# EAGLE schematic rc-driver-dual-rev-b (EAGLE 7.2.0)
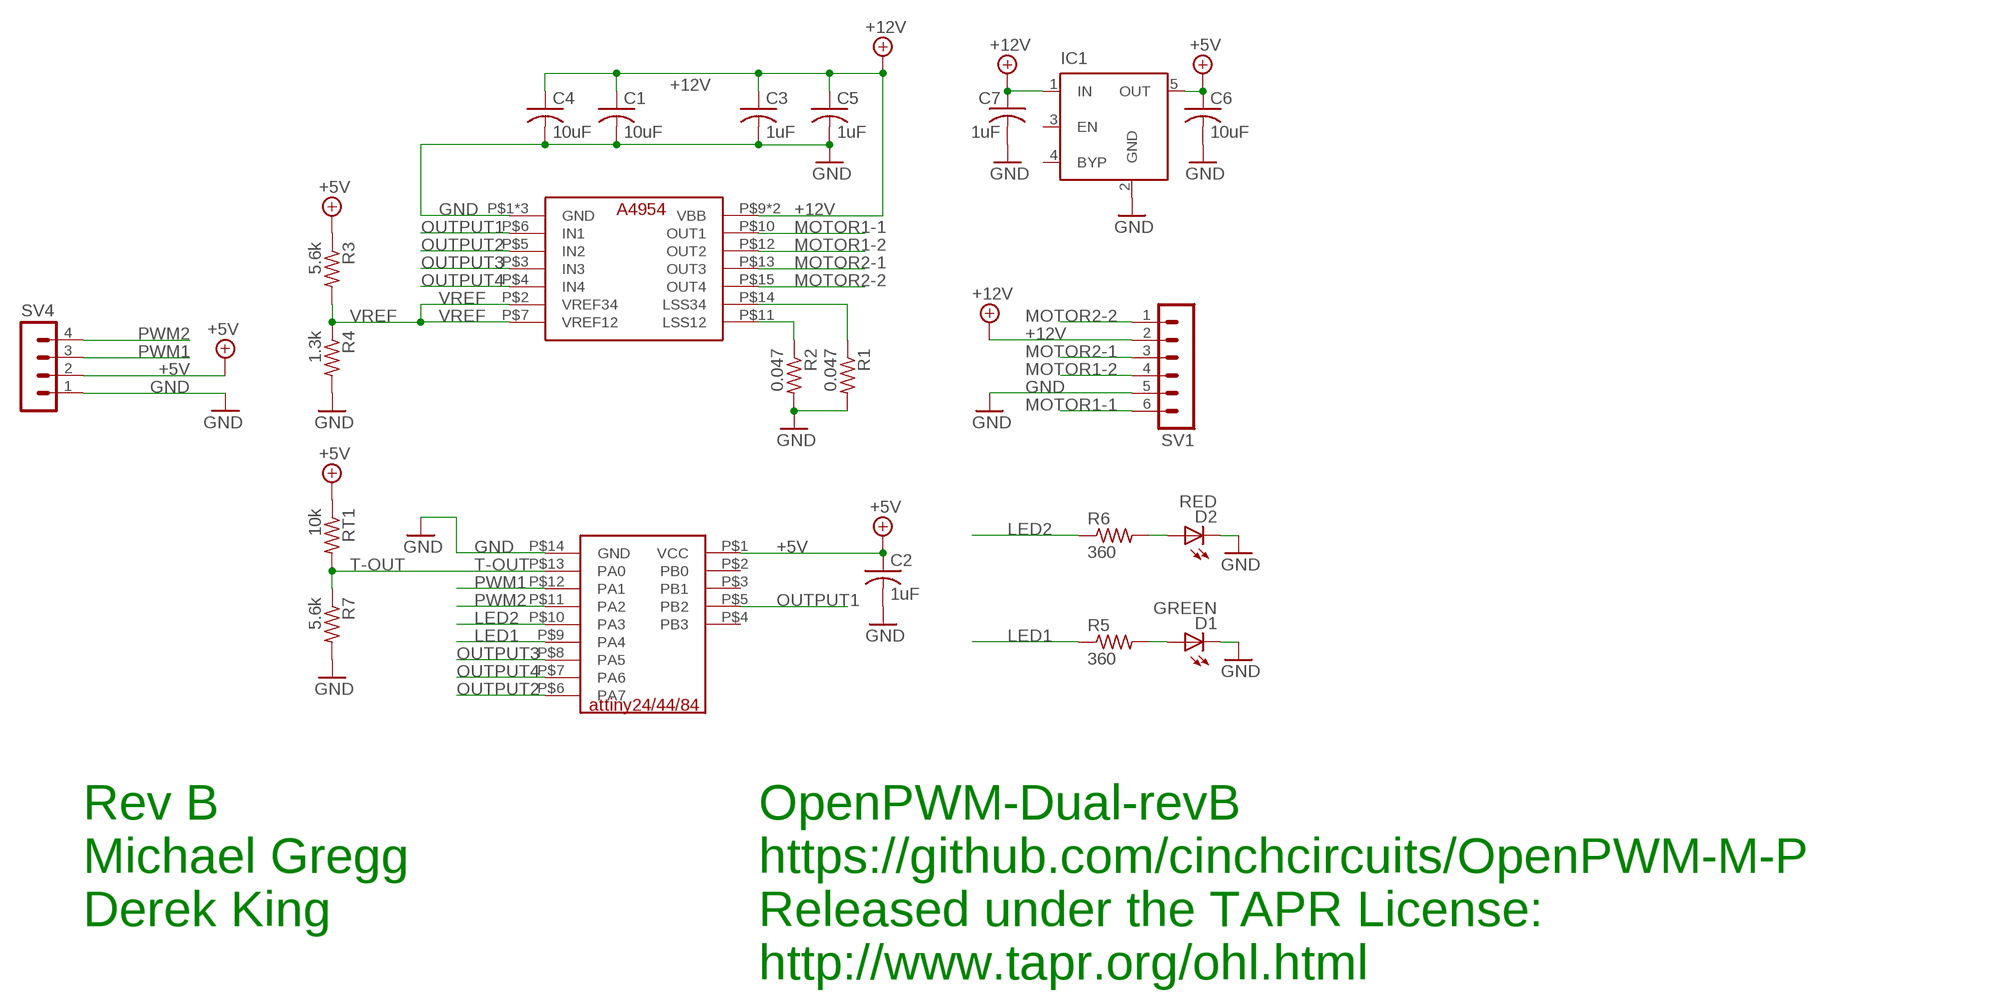
[diagram p0: schematic, sheet 1]

## Parts
C1  10uF  C-USC1206  [C1206]
C2  1uF  C-USC0603  [C0603]
C3  1uF  C-USC0603  [C0603]
C4  10uF  C-USC1206  [C1206]
C5  1uF  C-USC0603  [C0603]
C6  10uF  C-USC1206  [C1206]
C7  1uF  C-USC0603  [C0603]
D1  GREEN  LEDCHIPLED_0603  [CHIPLED_0603]
D2  RED  LEDCHIPLED_0603  [CHIPLED_0603]
IC1  MIC5219XX  [SOT23-5]
R1  0.047  R-US_R0805  [R0805]
R2  0.047  R-US_R0805  [R0805]
R3  5.6k  R-US_R0603  [R0603]
R4  1.3k  R-US_R0603  [R0603]
R5  360  R-US_R0603  [R0603]
R6  360  R-US_R0603  [R0603]
R7  5.6k  R-US_R0603  [R0603]
RT1  10k  R-US_R0603  [R0603]
SV1  MA06-1  [MA06-1]
SV4  MA04-1  [MA04-1]
U$1  ATTINY24A  [SOIC-14-WIDE]
U$2  A4954-DUAL-HBRIDGE  [TSSOP-16-LP]

## Nets
+5V: C2.1 C6.1 IC1.5(OUT) R3.1 RT1.1 SV4.2 U$1.P$1(VCC)
+12V: C1.1 C3.1 C4.1 C5.1 C7.1 IC1.1(IN) SV1.2 U$2.P$9(VBB) U$2.P$16(VBB)
GND: C1.2 C2.2 C3.2 C4.2 C5.2 C6.2 C7.2 D1.C D2.C IC1.2(GND) R1.2 R2.2 R4.2 R7.2 SV1.5 SV4.1 U$1.P$14(GND) U$2.P$1(GND) U$2.P$8(GND) U$2.P$17(GND)
LED1: R5.1 U$1.P$9(PA4)
LED2: R6.1 U$1.P$10(PA3)
MOTOR1-1: SV1.6 U$2.P$10(OUT1)
MOTOR1-2: SV1.4 U$2.P$12(OUT2)
MOTOR2-1: SV1.3 U$2.P$13(OUT3)
MOTOR2-2: SV1.1 U$2.P$15(OUT4)
N$1: R1.1 U$2.P$14(LSS34)
N$2: R2.1 U$2.P$11(LSS12)
N$3: D2.A R6.2
N$4: D1.A R5.2
OUTPUT1: U$1.P$5(PB2) U$2.P$6(IN1)
OUTPUT2: U$1.P$6(PA7) U$2.P$5(IN2)
OUTPUT3: U$1.P$8(PA5) U$2.P$3(IN3)
OUTPUT4: U$1.P$7(PA6) U$2.P$4(IN4)
PWM1: SV4.3 U$1.P$12(PA1)
PWM2: SV4.4 U$1.P$11(PA2)
T-OUT: R7.1 RT1.2 U$1.P$13(PA0)
VREF: R3.2 R4.1 U$2.P$2(VREF34) U$2.P$7(VREF12)
Unconnected: IC1.3(EN) IC1.4(BYP) U$1.P$2(PB0) U$1.P$3(PB1) U$1.P$4(PB3)

## Notes on the sheet
- Rev B | OpenPWM-Dual-revB
- Michael Gregg | https://github.com/cinchcircuits/OpenPWM-M-P
- Derek King | Released under the TAPR License:
- http://www.tapr.org/ohl.html

## Library data of the parts
C1-C7 = resistor:C-US: CAPACITOR, American symbol
D1 D2 = led:LED: LED OSRAM: - CHIPLED LG R971, LG N971, LY N971, LG Q971, LY Q971, LO R971, LY R971 LH N974, LH R974 LS Q976, LO Q976, LY Q976 LO Q996 - Hyper CHIPLED LW Q18S LB Q993, LB Q99A, LB R99A - SideLED LS A670, LO A670, LY A670, LG A670, LP A670 LB A673, LV A673, LT A673, LW A673 LH A674 LY A675 LS A676, LA A676, LO A676, LY A676, LW A676 LS A679, LY A679, LG A679 - Hyper Micro SIDELED® LS Y876, LA Y876, LO Y876, LY Y876 LT Y87S - SmartLED LW L88C, LW L88S LB L89C, LB L89S, LG L890 LS L89K, LO L89K, LY L89K LS L896, LA L896, LO L896, LY L896 - TOPLED LS T670, LO T670, LY T670, LG T670, LP T670 LSG T670, LSP T670, LSY T670, LOP T670, LYG T670 LG T671, LOG T671, LSG T671 LB T673, LV T673, LT T673, LW T673 LH T674 LS T676, LA T676, LO T676, LY T676, LB T676, LH T676, LSB T676, LW T676 LB T67C, LV T67C, LT T67C, LS T67K, LO T67K, LY T67K, LW E67C LS E67B, LA E67B, LO E67B, LY E67B, LB E67C, LV E67C, LT E67C LW T67C LS T679, LY T679, LG T679 LS T770, LO T770, LY T770, LG T770, LP T770 LB T773, LV T773, LT T773, LW T773 LH T774 LS E675, LA E675, LY E675, LS T675 LS T776, LA T776, LO T776, LY T776, LB T776 LHGB T686 LT T68C, LB T68C - Hyper Mini TOPLED® LB M676 - Mini TOPLED Santana® LG M470 LS M47K, LO M47K, LY M47K Source: http://www.osram.convergy.de LUXEON: - LUMILED® LXK2-PW12-R00, LXK2-PW12-S00, LXK2-PW14-U00, LXK2-PW14-V00 LXK2-PM12-R00, LXK2-PM12-S00, LXK2-PM14-U00 LXK2-PE12-Q00, LXK2-PE12-R00, LXK2-PE12-S00, LXK2-PE14-T00, LXK2-PE14-U00 LXK2-PB12-K00, LXK2-PB12-L00, LXK2-PB12-M00, LXK2-PB14-N00, LXK2-PB14-P00, LXK2-PB14-Q00 LXK2-PR12-L00, LXK2-PR12-M00, LXK2-PR14-Q00, LXK2-PR14-R00 LXK2-PD12-Q00, LXK2-PD12-R00, LXK2-PD12-S00 LXK2-PH12-R00, LXK2-PH12-S00 LXK2-PL12-P00, LXK2-PL12-Q00, LXK2-PL12-R00 Source: www.luxeon.com KINGBRIGHT: KA-3528ASYC Source: www.kingbright.com
IC1 = v-reg-micrel:MIC5219XX: VOLTAGE REGULATOR; MF: Texas Instruments; MPN: TPS70950; OC_FARNELL: unknown; OC_NEWARK: unknown
R1-R7 RT1 = resistor:R-US_: RESISTOR, American symbol
SV1 = con-lstb:MA06-1: PIN HEADER; OC_FARNELL: unknown; OC_NEWARK: unknown
SV4 = con-lstb:MA04-1: PIN HEADER; OC_FARNELL: unknown; OC_NEWARK: unknown
U$1 = rc-parts:ATTINY24A; MF: Atmel; MPN: ATTINY24A-SSUR
U$2 = rc-parts:A4954-DUAL-HBRIDGE; MF: Allegro; MPN: A4954